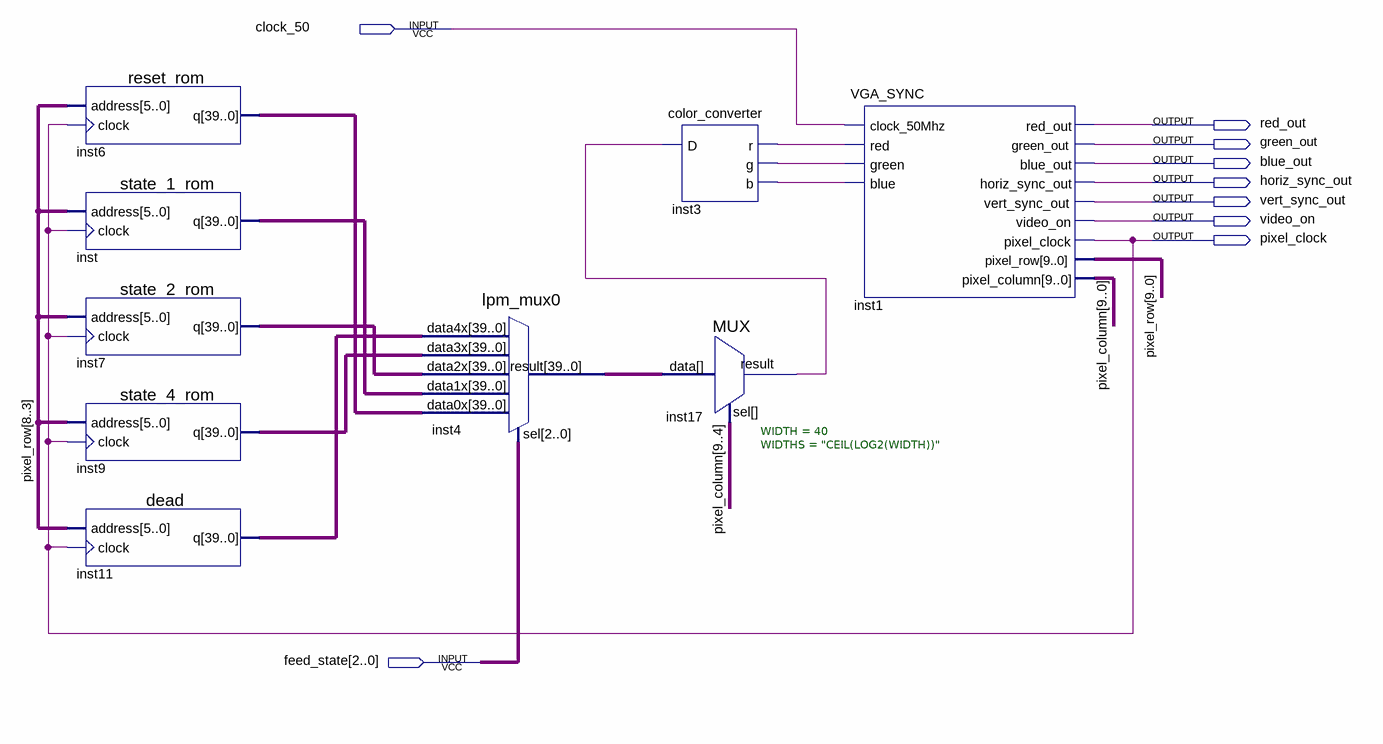
[diagram p0: schematic sheet]
// Quartus schematic Display.bdf as structural Verilog: 9 symbols, 9 pins
module Display (
  input  clock_50,
  input  [2:0] feed_state,
  output red_out,
  output green_out,
  output blue_out,
  output horiz_sync_out,
  output vert_sync_out,
  output video_on,
  output pixel_clock
);

  wire inst3_b, inst3_g, inst3_r, inst17_result;
  wire [9:0] pixel_column, pixel_row;
  wire [39:0] inst4_result, inst6_q, inst7_q, inst9_q, inst11_q, inst_q;

  reset_rom inst6 (.address(pixel_row[8:3]), .clock(pixel_clock), .q(inst6_q));
  state_1_rom inst (.address(pixel_row[8:3]), .clock(pixel_clock), .q(inst_q));
  state_2_rom inst7 (.address(pixel_row[8:3]), .clock(pixel_clock), .q(inst7_q));
  state_4_rom inst9 (.address(pixel_row[8:3]), .clock(pixel_clock), .q(inst9_q));
  dead inst11 (.address(pixel_row[8:3]), .clock(pixel_clock), .q(inst11_q));
  lpm_mux0 inst4 (
    .data4x(inst11_q), .data3x(inst9_q), .data2x(inst7_q), .data1x(inst_q), .data0x(inst6_q),
    .sel(feed_state), .result(inst4_result));
  color_converter inst3 (.D(inst17_result), .r(inst3_r), .g(inst3_g), .b(inst3_b));
  MUX #(.WIDTH(40), .WIDTHS("CEIL(LOG2(WIDTH))")) inst17 (
    .data(inst4_result), .sel(pixel_column[9:4]), .result(inst17_result));
  VGA_SYNC inst1 (
    .clock_50Mhz(clock_50), .red(inst3_r), .green(inst3_g), .blue(inst3_b), .red_out(red_out),
    .green_out(green_out), .blue_out(blue_out), .horiz_sync_out(horiz_sync_out),
    .vert_sync_out(vert_sync_out), .video_on(video_on), .pixel_clock(pixel_clock), .pixel_row(pixel_row),
    .pixel_column(pixel_column));
endmodule
